# Altium project Datalogger.PrjPcb (part 1 of 2)
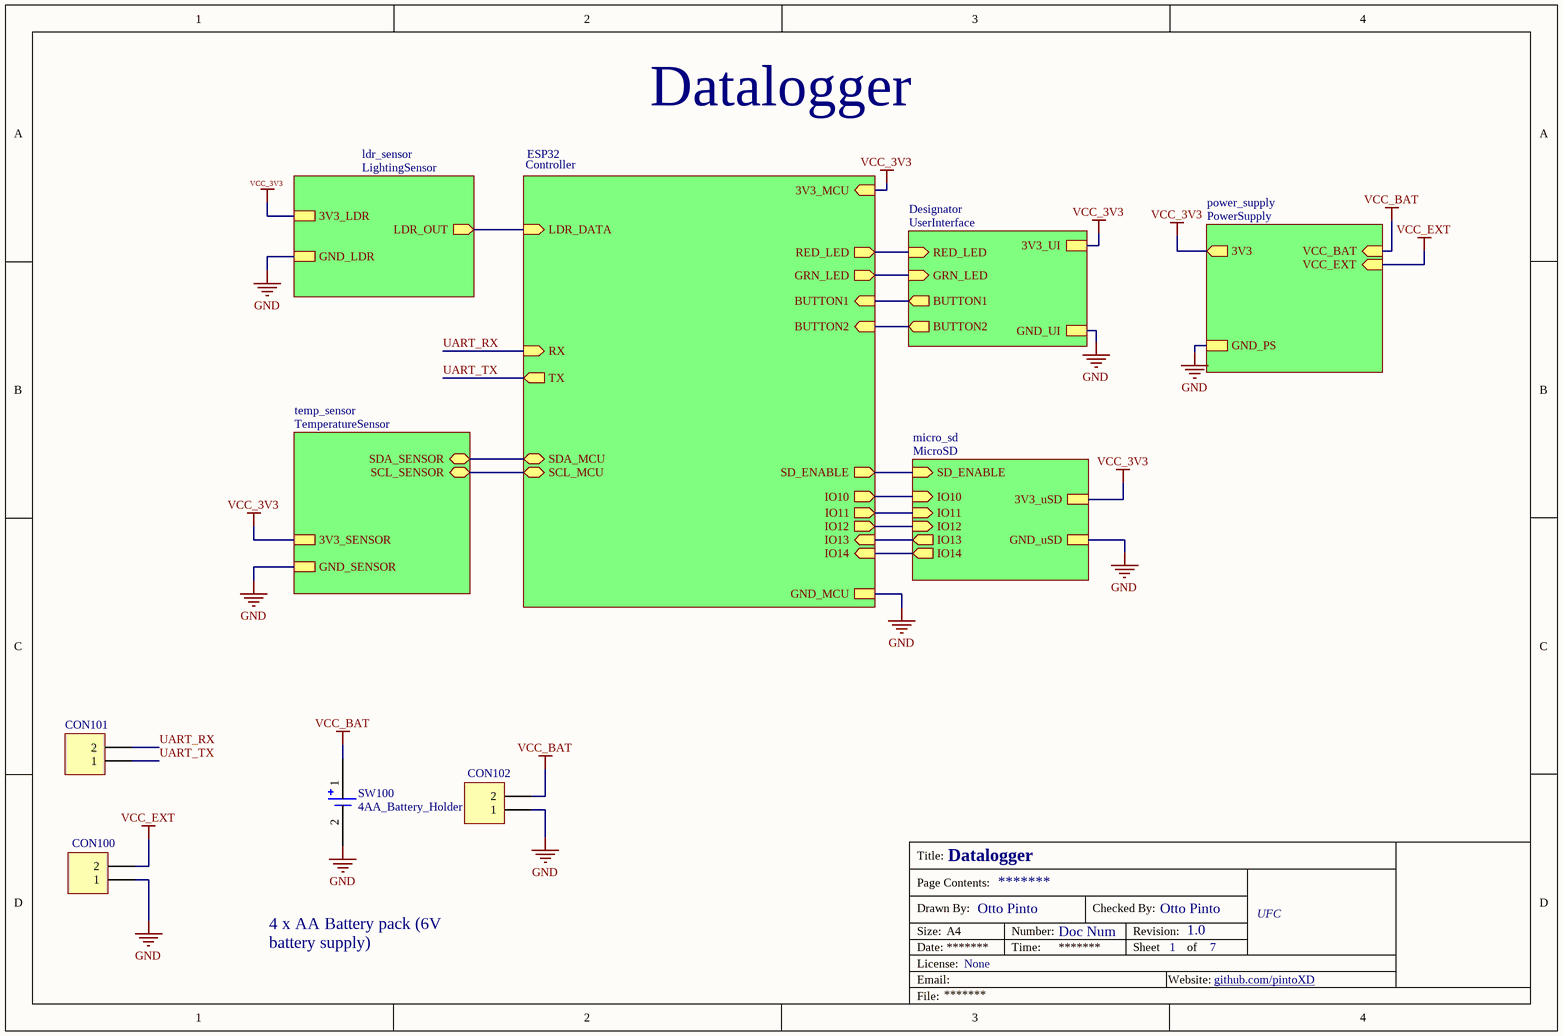
[diagram p0: datalogger.SchDoc]
VersionRevision: 1.0; RevisadoPor: Otto Pinto; Project: Datalogger; ProductName: Datalogger; Name: Otto Pinto; MY_EMAIL: ottolopes20@gmail.com; License: None; E-Mail: =MY_EMAIL; DocumentNumber: 1; DesenhadoPor: Otto Pinto; Company: UFC; Address_Website: github.com/pintoXD
7 sheets, 39 parts. Net scope: hierarchical (ports join the sheet entries above them; power ports are global).
Board file: datalogger.PcbDoc
Sheets:
  datalogger.SchDoc
    ESP32 = Controller.SchDoc
    power_supply = PowerSupply.SchDoc
    temp_sensor = TemperatureSensor.SchDoc
    ldr_sensor = LightingSensor.SchDoc
    micro_sd = MicroSD.SchDoc
    Designator = UserInterface.SchDoc

## Sheet datalogger.SchDoc: Datalogger
size A4; Title2: Datalogger; ENG_APP_DATE: --/--/--; DSN_APP_DATE: --/--/--; CHK_APP_DATE: --/--/--; Date: *******; ApprovedBy: *******; CheckedBy: None; Author: *******; CompanyName: *******; DrawnBy: Otto Pinto; Engineer: *******; Organization: *******; Address1: *******; Address2: *******; Address3: *******; Address4: *******; DocumentNumber: Doc Num; Revision: *******; SheetNumber: 1; SheetTotal: 7; CurrentTime: *******; CurrentDate: *******; Time: *******; DocumentFullPathAndName: *******; DocumentName: *******; ModifiedDate: *******; ImagePath: *******; ProjectName: *******; Application_BuildNumber: *******

### Parts
CON100  PIN HEADER 2POS  [FP-TSW-102-07-G-S-MFG]  (value not drawn)
CON101  PIN HEADER 2POS  [FP-TSW-102-07-G-S-MFG]  (value not drawn)
CON102  PIN HEADER 2POS  [FP-TSW-102-07-G-S-MFG]  (value not drawn)
SW100  4AA_Battery_Holder  [4AAA_BATTERY_HOLDER]

### Sub-sheets
Designator = UserInterface: GRN_LED (in), BUTTON1 (out), BUTTON2 (out), RED_LED (in), 3V3_UI, GND_UI
ESP32 = Controller: 3V3_MCU (in), SDA_MCU (bidir), SCL_MCU (bidir), LDR_DATA (in), GND_MCU, TX (out), RX (in), SD_ENABLE (out), GRN_LED (out), BUTTON1 (in), BUTTON2 (in), RED_LED (out), IO10 (out), IO11 (out), IO12 (out), IO13 (in), IO14 (in)
ldr_sensor = LightingSensor: 3V3_LDR, GND_LDR, LDR_OUT (out)
micro_sd = MicroSD: IO10 (in), IO11 (in), IO12 (in), IO13 (out), 3V3_uSD, GND_uSD, SD_ENABLE (in), IO14 (out)
power_supply = PowerSupply: VCC_BAT (in), VCC_EXT (in), 3V3 (out), GND_PS
temp_sensor = TemperatureSensor: SDA_SENSOR (bidir), SCL_SENSOR (bidir), 3V3_SENSOR, GND_SENSOR

### Nets
GND: CON100.1 CON102.1 SW100.2 ; sheet ESP32/GND_MCU, sheet power_supply/GND_PS, sheet temp_sensor/GND_SENSOR, sheet ldr_sensor/GND_LDR, sheet micro_sd/GND_uSD, sheet Designator/GND_UI
VCC_3V3: sheet ESP32/3V3_MCU, sheet power_supply/3V3, sheet temp_sensor/3V3_SENSOR, sheet ldr_sensor/3V3_LDR, sheet micro_sd/3V3_uSD, sheet Designator/3V3_UI  [project net 3V3]
VCC_BAT: CON102.2 SW100.1 ; sheet power_supply/VCC_BAT
VCC_EXT: CON100.2 ; sheet power_supply/VCC_EXT
BT1: sheet ESP32/BUTTON1, sheet Designator/BUTTON1
BT2: sheet ESP32/BUTTON2, sheet Designator/BUTTON2
CD: sheet ESP32/IO14, sheet micro_sd/IO14
CLK: sheet ESP32/IO12, sheet micro_sd/IO12
CMD: sheet ESP32/IO11, sheet micro_sd/IO11
D0: sheet ESP32/IO13, sheet micro_sd/IO13
D3: sheet ESP32/IO10, sheet micro_sd/IO10
GRN: sheet ESP32/GRN_LED, sheet Designator/GRN_LED
LDR_DATA: sheet ESP32/LDR_DATA, sheet ldr_sensor/LDR_OUT
RED: sheet ESP32/RED_LED, sheet Designator/RED_LED
SCL_SENSOR: sheet ESP32/SCL_MCU, sheet temp_sensor/SCL_SENSOR
SD_EN: sheet ESP32/SD_ENABLE, sheet micro_sd/SD_ENABLE
SDA_SENSOR: sheet ESP32/SDA_MCU, sheet temp_sensor/SDA_SENSOR
UART_RX: CON101.2 ; sheet ESP32/RX  [project net RXD0]
UART_TX: CON101.1 ; sheet ESP32/TX  [project net TXD0]

### Notes on the sheet
- 4 x AA Battery pack (6V battery supply)
- Title:
- Drawn By:
- Page Contents:
- Checked By:
- Size:
- Date:
- File:
- License:
- Email:
- A4
- Number:
- Time:
- Revision:
- Sheet
- Website:
- of

### Library data of the parts
CON100-CON102 = CMP-002-00076-1: Conn Unshrouded Header HDR 2 POS 2.54mm Solder ST Top Entry Thru-Hole Bulk; Manufacturer Part Number: TSW-102-07-G-S; Gender: Male; Connector Type: Male Pin; Max Current Rating: 7.6A; Number of Contacts: 2; Max Voltage Rating (AC): 550V; Length: 5.08mm; Depth: 2.54mm; Orientation: Straight; Termination: Solder; Packaging: Bulk; Number of Rows: 1; Contact Material: Bronze; Housing Color: Black; Pitch: 2.54mm; Contact Mating Length: 0.23inch; RoHS Compliant: Yes; Lead Free: Lead Free; Contact Type: Male Pin; Series: TSW; Contact Plating: Gold; Color: Black; Min Operating Temperature: -55°C; REACH SVHC: No SVHC; Housing Material: Polyester; Number of Positions: 2; Mount: Through Hole; Package Quantity: 1; Max Operating Temperature: 125°C
SW100 = 4AAA_battery_holder: Enclosure; Accessory; Battery Holder; Polypropylene; 26ga. 6in Leads; 4-AA; 4 * AA Battery Electronic Plastic Battery Case Storage Shell Box Holder with Wire Leads; Manufacturer: Bud Industries; Manufacturer Part Number: HH-3633; Number of Cells: 4; Supplier 1: Newark; RoHS: Yes; Category: Batteries and Accessories; Stock 1: 555; Pricing 1: 1=3,20000, 10=3,07000, 25=2,94000, 50=2,80000, 100=2,67000, 250=2,40000 (USD); Mount: Chassis; Material: PP,Polypropylene; Body Material: Polypropylene; Weight: 0.43oz; Color: Black; Package Quantity: 1; Termination: Wire Leads; Number of Batteries: 4; REACH SVHC: Unknown; Lead Free: Lead Free; ComponentLink1URL: https://datasheet.ciiva.com/4628/hb3633-36618-4628665.pdf?src-supplier=Mouser; ComponentLink1Description: https://datasheet.ciiva.com/4628/hb3633-36618-4628665.pdf?src-supplier=Mouser; ComponentLink2URL: https://datasheet.ciiva.com/16495/hb3633-16495410.pdf?src-supplier=Future+Electronics; ComponentLink2Description: https://datasheet.ciiva.com/16495/hb3633-16495410.pdf?src-supplier=Future+Electronics; ComponentLink3URL: https://datasheet.ciiva.com/1438/1807993-1438161.pdf?src-supplier=Newark; ComponentLink3Description: https://datasheet.ciiva.com/1438/1807993-1438161.pdf?src-supplier=Newark; Supplier Part Number 1: 34M2187

## Sheet Controller.SchDoc: Controle
size A4; ENG_APP_DATE: --/--/--; DSN_APP_DATE: --/--/--; CHK_APP_DATE: --/--/--; Date: *******; ApprovedBy: *******; CheckedBy: None; Author: *******; CompanyName: *******; Engineer: *******; Organization: *******; Address1: *******; Address2: *******; Address3: *******; Address4: *******; DocumentNumber: Doc Num; Revision: *******; SheetNumber: 2; SheetTotal: 7; CurrentTime: *******; CurrentDate: *******; Time: *******; DocumentFullPathAndName: *******; DocumentName: *******; ModifiedDate: *******; ImagePath: *******; ProjectName: *******; Application_BuildNumber: *******
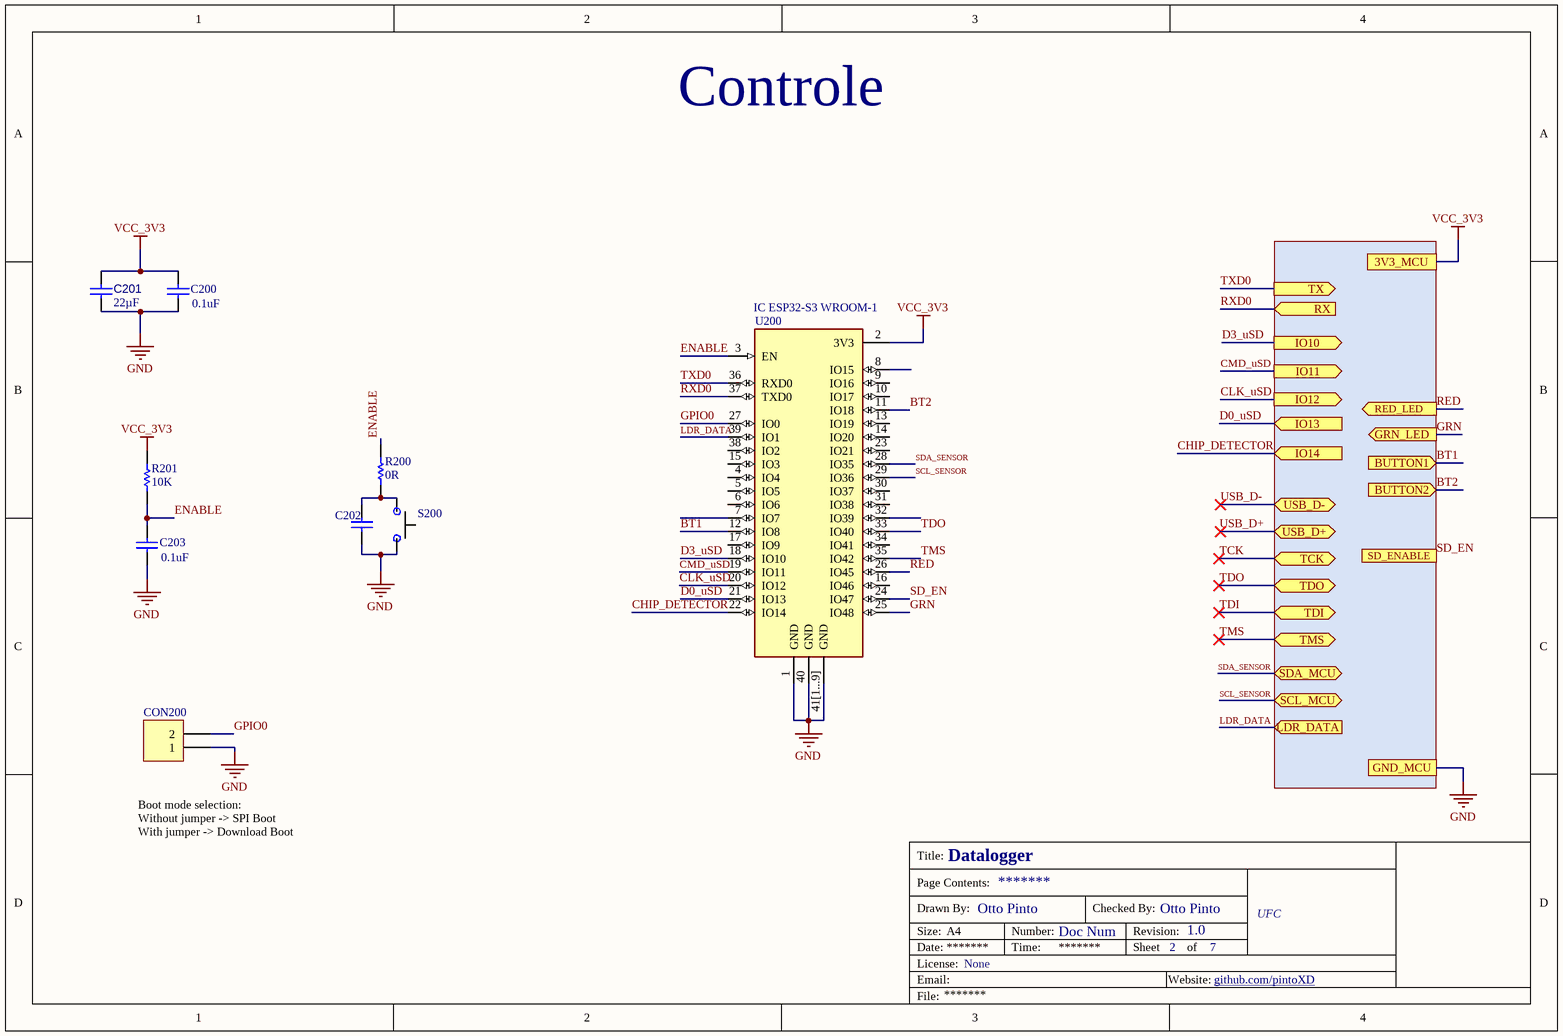
[diagram p1: Controller.SchDoc]

### Parts
C200  0.1uF  [CC2012-0805]
C201  value 22µF  [CC2012-0805]  (hidden comment: Capacitor 22µF +/-40% 16V 0805)
C202  CAP CER 0.1uF 100V X7R SMD 0805  [CC2012-0805]  (value not drawn)
C203  0.1uF  [CC2012-0805]
CON200  PIN HEADER 2POS  [FP-TSW-102-07-G-S-MFG]  (value not drawn)
R200  0R  [RESC2013X50X35ML15T15]
R201  10K  [CR2012-0805]
S200  SWITCH TACTILE SPST-NO 0.05A 12V SMD  [SWITCH_TACTILE_SMD_2PIN]  (value not drawn)
U200  IC ESP32-S3 WROOM-1  [ESP32_S3_WROOM_1]

### Ports
3V3_MCU, BUTTON1 (in), BUTTON2 (in), GND_MCU, GRN_LED (out), IO10 (out), IO11 (out), IO12 (out), IO13 (in), IO14 (in), LDR_DATA (in), RED_LED (out), RX (in), SCL_MCU (bidir), SD_ENABLE (out), SDA_MCU (bidir), TCK (bidir), TDI (bidir), TDO (bidir), TMS (bidir), TX (out), USB_D+ (bidir), USB_D- (bidir)

### Nets
GND: C200.1 C201.1 C202.1 C203.1 CON200.1 S200.1 U200.1(GND) U200.40(GND) U200.41[1...9](GND) ; port GND_MCU
VCC_3V3: C200.2 C201.2 R201.2 U200.2(3V3) ; port 3V3_MCU  [project net 3V3]
BT1: U200.12(IO8) ; port BUTTON1
BT2: U200.11(IO18) ; port BUTTON2
CHIP_DETECTOR: U200.22(IO14) ; port IO14  [project net CD]
CLK_uSD: U200.20(IO12) ; port IO12  [project net CLK]
CMD_uSD: U200.19(IO11) ; port IO11  [project net CMD]
D0_uSD: U200.21(IO13) ; port IO13  [project net D0]
D3_uSD: U200.18(IO10) ; port IO10  [project net D3]
ENABLE: C203.2 R200.2 R201.1 U200.3(EN)
GPIO0: CON200.2 U200.27(IO0)
GRN: U200.25(IO48) ; port GRN_LED
LDR_DATA: U200.39(IO1) ; port LDR_DATA
RED: U200.26(IO45) ; port RED_LED
RXD0: U200.37(TXD0) ; port RX
SCL_SENSOR: U200.29(IO36) ; port SCL_MCU
SD_EN: U200.24(IO47) ; port SD_ENABLE
SDA_SENSOR: U200.28(IO35) ; port SDA_MCU
TCK: port TCK
TDI: port TDI
TDO: U200.33(IO40) ; port TDO
TMS: U200.35(IO42) ; port TMS
TXD0: U200.36(RXD0) ; port TX
USB_D-: port USB_D-
NetC202_2: C202.2 R200.1 S200.2

Not connected (* = marked no-connect by the designer): U200 4(IO4) 5(IO5) 6(IO6) 7(IO7) 8(IO15) 9(IO16) 10(IO17) 13(IO19) 14(IO20) 15(IO3) 16(IO46) 17(IO9) 23(IO21) 30(IO37) 31(IO38) 32(IO39) 34(IO41) 38(IO2)

### Notes on the sheet
- (near CON200) Boot mode selection:
  Without jumper -> SPI Boot
  With jumper -> Download Boot
- Labels drawn without touching a wire or pin: USB_D+
- Title:
- Drawn By:
- Page Contents:
- Checked By:
- Size:
- Date:
- File:
- License:
- Email:
- A4
- Number:
- Time:
- Revision:
- Sheet
- Website:
- of

### Library data of the parts
C200 C202 C203 = CAP CER 0.1uF 25V 0805 SMD: Cap Ceramic 0.1uF 25V X7R 10% SMD 0805 125C Plastic T/R; Manufacturer: KEMET; Manufacturer Part Number: C0805C104K3RACTU; Capacitance: 100nF; Supplier 1: RSComponents; RoHS: Yes; Category: Ceramic Capacitors; Stock 1: 1910; Pricing 1: 10=0,13300, 100=0,12200, 250=0,11000, 500=0,09400, 1000=0,08300 (USD); Mount: PCB,Surface Mount; Case/Package: 0805; Case Code (Imperial): 0805; Case Code (Metric): 2012; Dielectric Material: Ceramic; Contact Plating: Tin,Matte; Min Operating Temperature: -55°C; Max Operating Temperature: 125°C; Packaging: Tape and Reel; Tolerance: 10%; Package Quantity: 4000; Voltage Rating: 25V; Series: C0805C; Voltage Rating (DC): 25V; Dielectric: X7R; Termination: SMD/SMT; Construction: Flat; Voltage: 25V; Length: 2mm; Width: 1.2mm; Height: 0.9mm; Depth: 1.25mm; Lead Pitch: 0.75mm; Radiation Hardening: No; RoHS Compliant: Yes; ComponentLink1URL: https://datasheet.ciiva.com/18193/getdatasheetpartid-385649-18193413.pdf?src-supplier=Verical; ComponentLink1Description: https://datasheet.ciiva.com/18193/getdatasheetpartid-385649-18193413.pdf?src-supplier=Verical; ComponentLink2URL: https://datasheet.ciiva.com/7842/kem-c1002-x7r-smd-7842536.pdf?src-supplier=Element14; ComponentLink2Description: https://datasheet.ciiva.com/7842/kem-c1002-x7r-smd-7842536.pdf?src-supplier=Element14; ComponentLink3URL: https://datasheet.ciiva.com/7842/kem-c1002-x7r-smd-7842538.pdf?src-supplier=Element14; ComponentLink3Description: https://datasheet.ciiva.com/7842/kem-c1002-x7r-smd-7842538.pdf?src-supplier=Element14; Supplier Part Number 1: 6480979
C201 = CMP-001-00081-6: Chip Capacitor, 22µF +/-40%, 16V, 0805, Thickness 1.45 mm; Tolerance: 5%; Mounting Technology: SMT; Min Operating Temperature: -55°C; Case/Package: 0805; Max Operating Temperature: 85°C; Voltage Rating: 16V; Pins: 2
CON200 = CMP-002-00076-1: as CON100 on sheet datalogger; Length: 5.08mm; Depth: 2.54mm; Orientation: Straight; Termination: Solder; Packaging: Bulk; Number of Rows: 1; Contact Material: Bronze; Housing Color: Black; Pitch: 2.54mm; Contact Mating Length: 0.23inch; RoHS Compliant: Yes; Lead Free: Lead Free; Contact Type: Male Pin; Series: TSW; Contact Plating: Gold; Color: Black; Min Operating Temperature: -55°C; REACH SVHC: No SVHC; Housing Material: Polyester; Number of Positions: 2; Mount: Through Hole; Package Quantity: 1; Max Operating Temperature: 125°C
R200 = CMP-009-00001-6: Chip Resistor, 0 Ohm, +/- 1%, 125 mW, -55 to 155 degC, 0805 (2012 Metric); Power: 125mW; Voltage Rating: 150V; Value: 0; Case/Package: 0805; Tolerance: 1%; Pins: 2; Mounting Technology: SM; Max Operating Temperature: 155°C; Min Operating Temperature: -55°C; RoHS Compliant: True
R201 = CMP-018-000030-1: RES 0805 10K Ohm 0.1% 1/10W  SMD; Manufacturer Part Number: ERJ-6ENF1002V; Manufacturer: Panasonic Electronic Components; Number of Resistors: 1; Voltage Rating (DC): 150V; Max Power Dissipation: 125mW; Temperature Coefficient: ±100ppm/°C; Tolerance: ±1%; Resistance: 10kR; Power (Watts): 0.125W, 1/8W; ComponentLink6URL: https://datasheet.ciiva.com/16725/70260748-16725031.pdf?src-supplier=Allied+Electronics; Package / Case: 0805 (2012 Metric); Supplier Device Package: 0805; Resistance (Ohms): 10k; ComponentLink14Description: https://datasheet.ciiva.com/24440/eng-ds-1773270-l-24440188.pdf?src-supplier=Onlinecomponents.com; Operating Temperature: -55°C ~ 155°C; ComponentLink15Description: https://datasheet.ciiva.com/7731/eng-ds-1773270-l-7731311.pdf?src-supplier=Element14; ComponentLink7Description: https://datasheet.ciiva.com/46372/1678782-46372714.pdf?src-supplier=Element14; ComponentLink13Description: https://datasheet.ciiva.com/16723/70063741-16723029.pdf?src-supplier=Allied+Electronics; Contact Plating: Tin; Part Status: Active; ComponentLink11Description: https://datasheet.ciiva.com/30140/aoa0000ce2-30140236.pdf?src-supplier=Onlinecomponents.com; ComponentLink6Description: https://datasheet.ciiva.com/16725/70260748-16725031.pdf?src-supplier=Allied+Electronics; Lead Free: Lead Free; ComponentLink14URL: https://datasheet.ciiva.com/24440/eng-ds-1773270-l-24440188.pdf?src-supplier=Onlinecomponents.com; Design Item ID: RES 10K OHM 1% 1/8W 0805 SMD; ComponentLink7URL: https://datasheet.ciiva.com/46372/1678782-46372714.pdf?src-supplier=Element14; ComponentLink3Description: https://datasheet.ciiva.com/16514/aoa0000ce2-16514021.pdf?src-supplier=Avnet+Asia; Category: Resistors; ComponentLink13URL: https://datasheet.ciiva.com/16723/70063741-16723029.pdf?src-supplier=Allied+Electronics; Case Code (Imperial): 0805; Failure Rate: -; Stock 1: 2392770; ComponentLink5URL: https://datasheet.ciiva.com/16759/70260748-16759350.pdf?src-supplier=Allied+Electronics; Features: Automotive AEC-Q200; ComponentLink12URL: https://datasheet.ciiva.com/24070/aoa0000ce2-24070702.pdf?src-supplier=Mouser; ComponentLink9URL: https://datasheet.ciiva.com/7830/426256-7830745.pdf?src-supplier=Element14; Termination: SMD/SMT; ComponentLink10Description: https://datasheet.ciiva.com/17212/aoa0000ce2-17212108.pdf?src-supplier=Avnet+Europe; Length: 2mm; ComponentLink15URL: https://datasheet.ciiva.com/7731/eng-ds-1773270-l-7731311.pdf?src-supplier=Element14; ComponentLink8Description: https://datasheet.ciiva.com/46372/1678782-46372715.pdf?src-supplier=Element14; ComponentLink11URL: https://datasheet.ciiva.com/30140/aoa0000ce2-30140236.pdf?src-supplier=Onlinecomponents.com; Size / Dimension: 0.079" L x 0.049" W (2.00mm x 1.25mm); ComponentLink9Description: https://datasheet.ciiva.com/7830/426256-7830745.pdf?src-supplier=Element14; REACH SVHC: No SVHC; Source: mits.SchLib; Military Standard: Not; ComponentLink5Description: https://datasheet.ciiva.com/16759/70260748-16759350.pdf?src-supplier=Allied+Electronics; ComponentLink1Description: https://industrial.panasonic.com/cdbs/www-data/pdf/RDA0000/AOA0000C283.pdf; ComponentLink16URL: https://datasheet.ciiva.com/14181/jcrn73-data-e-14181423.pdf?src-supplier=Distrelec; Stock 2: 1650; Working Voltage: 150V; ComponentLink8URL: https://datasheet.ciiva.com/46372/1678782-46372715.pdf?src-supplier=Element14; ComponentLink10URL: https://datasheet.ciiva.com/17212/aoa0000ce2-17212108.pdf?src-supplier=Avnet+Europe; Number of Pins: 2; Height: 0.6mm; ComponentLink4Description: https://datasheet.ciiva.com/27055/1988971-27055733.pdf?src-supplier=Jameco; ComponentLink4URL: https://datasheet.ciiva.com/27055/1988971-27055733.pdf?src-supplier=Jameco; Pricing 2: 1=1,68000, 10=1,48900, 100=1,13720, 1000=0,73645 (USD); Radiation Hardening: No; ComponentLink16Description: https://datasheet.ciiva.com/14181/jcrn73-data-e-14181423.pdf?src-supplier=Distrelec; Pricing 1: 1=0.1, 10=0.036, 25=0.0264, 50=0.02, 100=0.0148, 250=0.01124, 500=0.009, 1000=0.00663 (USD); ELV: Compliant; Width: 0.049inch; RoHS: RoHS Compliant; Number of Terminations: 2; ComponentLink2Description: https://datasheet.ciiva.com/11808/0900766b80f80784-11808080.pdf?src-supplier=RSComponents; Power Rating: 125mW; ComponentLink1URL: https://industrial.panasonic.com/cdbs/www-data/pdf/RDA0000/AOA0000C283.pdf; Mount: Surface Mount; Depth: 1.25mm; Case Code (Metric): 2012; ComponentLink12Description: https://datasheet.ciiva.com/24070/aoa0000ce2-24070702.pdf?src-supplier=Mouser; ComponentLink3URL: https://datasheet.ciiva.com/16514/aoa0000ce2-16514021.pdf?src-supplier=Avnet+Asia; ComponentLink2URL: https://datasheet.ciiva.com/11808/0900766b80f80784-11808080.pdf?src-supplier=RSComponents; Height - Seated (Max): 0.028" (0.70mm); Composition: Thick Film; Case/Package: 0805; Max Operating Temperature: 155°C; Packaging: Cut Tape (CT); Package Quantity: 5000; Voltage Rating: 150V; Min Operating Temperature: -55°C
S200 = CMP-019-000011-1: Switch Tactile N.O. SPST Rectangular Button J-Lead 0.05A 12VDC 2.55N SMD T/R; Manufacturer Part Number: TL3302BF260QJ; Manufacturer: E-Switch; Current Rating: 50mA; Operating Force: 260gf; Switch Travel: 0.25mm; Switch Function: Off-Mom; Actuator Material: Polyphenylene; Mechanical Life: 30000Cycles; Illumination Type: Non-Illuminated; ComponentLink1URL: https://datasheet.ciiva.com/2900/p020333b-2900880.pdf?src-supplier=Digi-Key; Design Item ID: SWITCH TACTILE SPST-NO 0.05A 12V SMD; Min Operating Temperature: -20°C; RoHS Compliant: Yes; Voltage Rating (DC): 12V; ComponentLink1Description: https://datasheet.ciiva.com/2900/p020333b-2900880.pdf?src-supplier=Digi-Key; Size: 11.4mm; Package Quantity: 1; Contact Plating: Silver; Lead Free: Lead Free; Termination: Gull Wing; Series: TL3302; Mount: Surface Mount; RoHS: Yes; Category: Tactile Switches; Stock 1: 19576; Throw Configuration: SPST; Packaging: Tape and Reel; Pricing 1: 1=0,82000, 10=0,79300, 25=0,74120, 100=0,64360, 250=0,58564, 500=0,54294 (USD); Source: mits.SchLib; Max Operating Temperature: 70°C
U200 = IC ESP32 S3 WROOM-1_v2: SMD Module, ESP32-S3R2 With 8 MB of Flash; Manufacturer Part Number: ESP32-S3-WROOM-1-N8; MF: Espressif Systems; SnapEDA_Link: https://www.snapeda.com/parts/ESP32-S3-WROOM-1U/Espressif+Systems/view-part/?ref=snap; Availability: Not in stock; Package: Package; Price: None; Value: *; Check_prices: https://www.snapeda.com/parts/ESP32-S3-WROOM-1U/Espressif+Systems/view-part/?ref=eda; Manufacturer: Espressif Systems; RoHS: No; Category: Uncategorized; Stock 1: 659; Pricing 1: 1=3,63000 (USD); Supplier 1: Digi-Key; Supplier Part Number 1: 1965-ESP32-S3-WROOM-1-N8CT-ND

## Sheet PowerSupply.SchDoc: Fonte de Alimentação
size A4; SPICEModelCacheZJBQYOKP: <root> / <DocumentId>ZJBQYOKP</DocumentId> / </root>; ENG_APP_DATE: --/--/--; DSN_APP_DATE: --/--/--; CHK_APP_DATE: --/--/--; Date: *******; ApprovedBy: *******; CheckedBy: None; Author: *******; CompanyName: *******; DrawnBy: Name; Engineer: *******; Organization: *******; Address1: *******; Address2: *******; Address3: *******; Address4: *******; DocumentNumber: Doc Num; Revision: *******; SheetNumber: 3; SheetTotal: 7; CurrentTime: *******; CurrentDate: *******; Time: *******; DocumentFullPathAndName: *******; DocumentName: *******; ModifiedDate: *******; ImagePath: *******; ProjectName: *******; Application_BuildNumber: *******
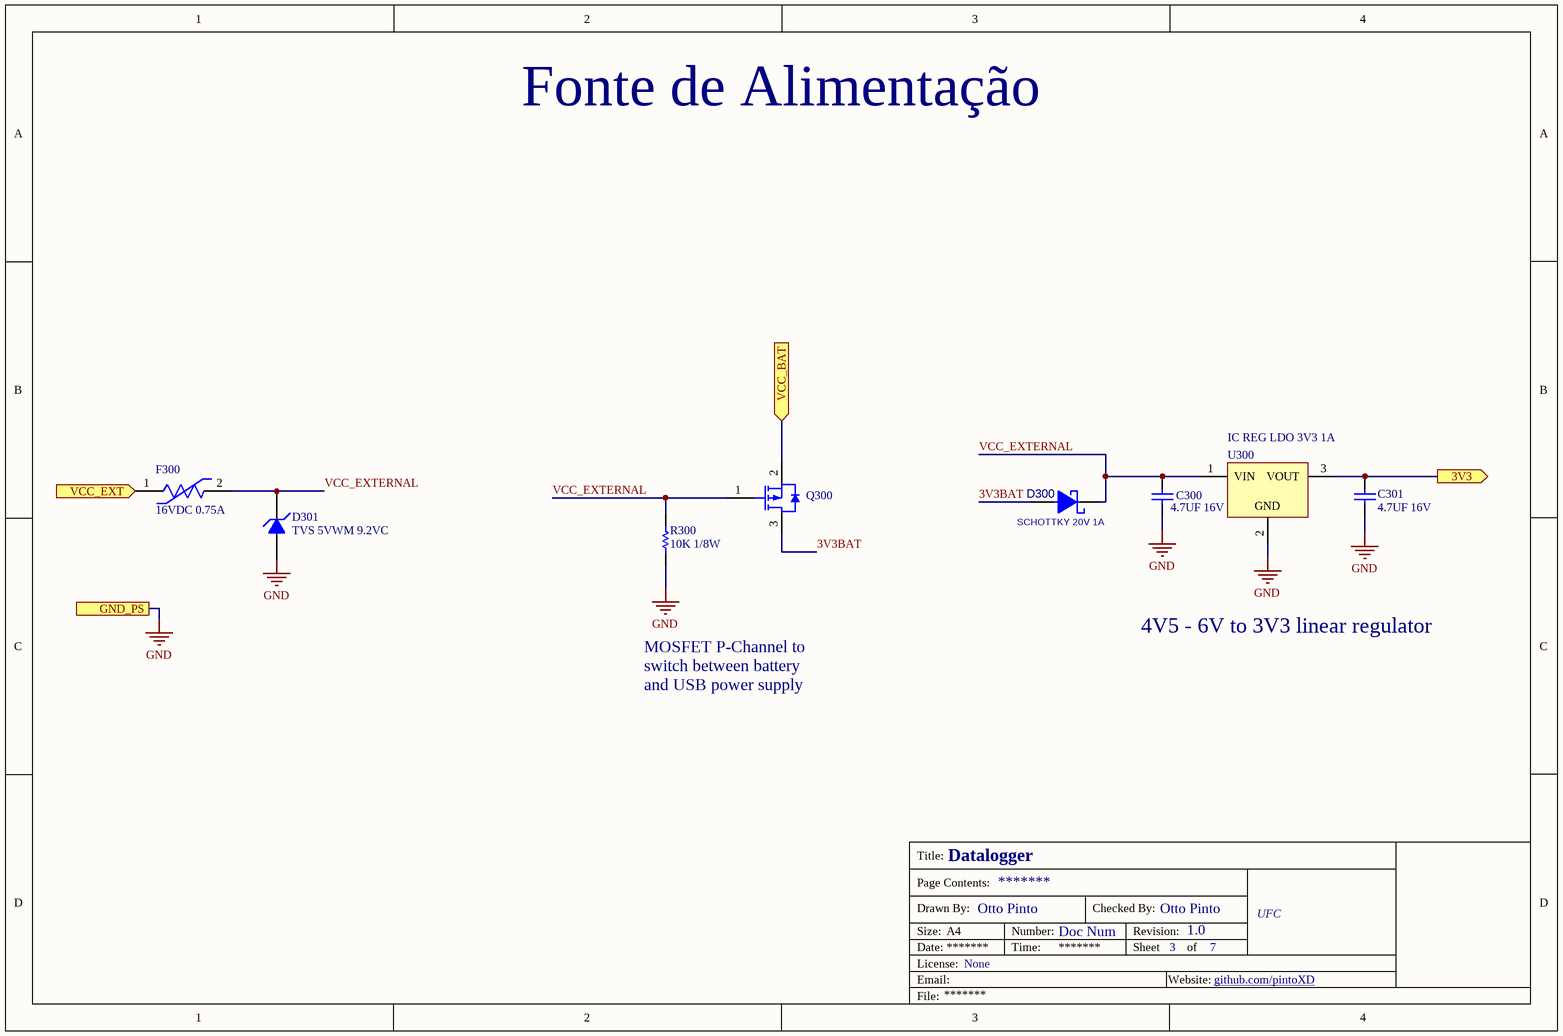
[diagram p2: PowerSupply.SchDoc]

### Parts
C300  4.7UF 16V  [CC2012-0805]
C301  4.7UF 16V  [CC2012-0805]
D300  SCHOTTKY 20V 1A  [SOD-323]
D301  TVS 5VWM 9.2VC  [DO-214AA(SMB)]
F300  16VDC 0.75A  [FP-0ZCJ0035FF2G-MFG]
Q300  IC MOSFET P_CHANNEL 20V 6A  [SOT-23]  (value not drawn)
R300  10K 1/8W  [CR2012-0805]
U300  IC REG LDO 3V3 1A  [SOT-223]

### Ports
3V3 (out), GND_PS, VCC_BAT (in), VCC_EXT (in)

### Nets
3V3: C301.2 U300.3(VOUT) ; port 3V3
GND: C300.1 C301.1 D301.2(A) R300.1 U300.2(GND) ; port GND_PS
VCC_BAT: Q300.2(SOURCE) ; port VCC_BAT
VCC_EXT: F300.1 ; port VCC_EXT
3V3BAT: D300.A Q300.3(DRAIN)
VCC_EXTERNAL: C300.2 D300.K D301.1(K) F300.2 Q300.1(GATE) R300.2 U300.1(VIN)

### Notes on the sheet
- 4V5 - 6V to 3V3 linear regulator
- MOSFET P-Channel to switch between battery and USB power supply
- Title:
- Drawn By:
- Page Contents:
- Checked By:
- Size:
- Date:
- File:
- License:
- Email:
- A4
- Number:
- Time:
- Revision:
- Sheet
- Website:
- of

### Library data of the parts
C300 C301 = CMP-004-000075-2: CAP CER 4.7UF 16V X7R 0805; Manufacturer Part Number 1: 0805F475M160NT; Manufacturer 1: FH(Guangdong Fenghua Advanced Tech); Tolerance: 10%; Radiation Hardening: No; Thickness: 0.057inch; Package Quantity: 1; REACH SVHC: No SVHC; Case Code (Imperial): 0805; Termination: SMD/SMT; Case/Package: 0805; Supplier Unit Price 1: 0,0214; Case Code (Metric): 2012; Dielectric: X7R; Ratings: AEC-Q200; Voltage Rating: 16V; Depth: 1.25mm; Length: 2mm; Source: mits.SchLib; Design Item ID: CAP CER 4.7uF 16V 20% Y5V 0805 SMD; Resistor Type: Ceramic; RoHS Compliant: Yes; Packaging: Tape and Reel; Weight: 0.000194oz; Min Operating Temperature: -55°C; Height: 1.25mm; Capacitance: 4.7uF; Voltage Rating (DC): 16V; Width: 0.049inch; Max Operating Temperature: 125°C; Series: CGA; Mount: Surface Mount; Lead Free: Lead Free
D300 = CMP-008-000014-1: DIODE SCHOTTKY 20V 1A SOD323; Manufacturer: ON Semiconductor; Manufacturer Part Number: NSR0320MW2T1G; Capacitance @ Vr, F: 29pF @ 5V, 1MHz; Speed: Fast Recovery =< 500ns, > 200mA (Io); Current - Reverse Leakage @ Vr: 50µA @ 15V; Current - Average Rectified (Io): 1A (DC); Voltage - Forward (Vf) (Max) @ If: 500mV @ 900mA; Pricing 1: 1=0.4, 10=0.298, 100=0.1689, 500=0.11188, 1000=0.08577 (USD); Design Item ID: DIODE SCHOTTKY NSR0320MW2T1G 20V 1A SOD323 SMD; Supplier Device Package: SOD-323; ComponentLink1URL: http://www.onsemi.com/pub_link/Collateral/NSR0320MW2T1-D.PDF; Packaging: Cut Tape (CT); Package / Case: SC-76, SOD-323; ComponentLink1Description: http://www.onsemi.com/pub_link/Collateral/NSR0320MW2T1-D.PDF; Reverse Recovery Time (trr): -; Voltage - DC Reverse (Vr) (Max): 20V; RoHS: RoHS Compliant; Mounting Type: Surface Mount; Diode Type: Schottky; Category: Discrete Semiconductor Products; Operating Temperature - Junction: -55°C ~ 125°C; Part Status: Active; Stock 1: 617; Source: mits.SchLib
D301 = CMP-004-00039-1: TVS DIODE 5VWM 9.2VC SMB; Element Configuration: Single; Number of Channels: 1; Test Current: 10mA; Voltage Rating (DC): 5V; Min Breakdown Voltage: 6.4V; Polarity: Unidirectional; Clamping Voltage: 9.2V; Leakage Current: 800uA; Max Surge Current: 65.3A; Max Power Dissipation: 600W; Current: 68A; Diode Type: ZENER; Power Line Protection: No; Max Breakdown Voltage: 7V; ESD Protection: Yes; Length: 4.57mm; Radiation Hardening: No; RoHS Compliant: Yes; Packaging: Cut Tape; Breakdown Voltage: 6.4V; Min Operating Temperature: -65°C; Voltage: 5V; Operating Supply Voltage: 5V; Reverse Breakdown Voltage: 6.4V; Peak Pulse Current: 65.3A; Max Operating Temperature: 150°C; Mount: Surface Mount; Number of Elements: 1; Termination: SMD/SMT; Package Quantity: 3000; Number of Unidirectional Channels: 1; Clamping Voltage-Max: 9.2V; Peak Pulse Power: 600W; Reverse Standoff Voltage: 5V; Direction: Unidirectional; Number of Pins: 2; Width: 3.94mm; Power Dissipation: 600W; Series: SMBJ; Case/Package: DO-214AA; Lead Free: Lead Free; Height: 2.237mm; Resistor Type: Zener; Max Reverse Leakage Current: 800uA; REACH SVHC: Unknown
F300 = CMP-005-00014-2: PTC Resettable Fuse 0.35A(hold) 0.75A(trip) 16VDC 40A 0.4W 0.1s 0.3Ohm SMD Solder Pad 1206 T/R Automotive; Trip Current: 750mA; Hold Current: 350mA; Time to Trip: 100ms; RoHS Compliant: Yes; Packaging: Cut Tape; Min Operating Temperature: -40°C; Mount: Surface Mount; Series: 0ZCJ; Case Code (Imperial): 1206; Case Code (Metric): 3216; Package Quantity: 1; Lead Free: Lead Free; Case/Package: 1206; Max Operating Temperature: 85°C; Max Current Rating: 40A
Q300 = IC MOSFET P_CHANNEL 20V 6A: Small Low ON Resistance MOSFET P-Channel 20V 6A 3-Pin SOT-23F T/R; Manufacturer: Toshiba; Manufacturer Part Number: SSM3J358R,LF; ComponentLink1URL: https://datasheet.ciiva.com/30023/dmp31d0u-30023794.pdf?src-supplier=Avnet; ComponentLink1Description: https://datasheet.ciiva.com/30023/dmp31d0u-30023794.pdf?src-supplier=Avnet; Supplier 1: Avnet; RoHS: No; Category: MOSFETs; Stock 1: 12000; Pricing 1: 3000=0,10175, 6000=0,09625, 12000=0,09075, 18000=0,08525, 24000=0,07975, 30000=0,07425, 300000=0,06875 (USD); Supplier 2: LCSC; Supplier Part Number 1: SSM3J358R,LF; Supplier Part Number 2: C148356
R300 = CMP-018-000030-1: as R201 on sheet Controller; ComponentLink6URL: https://datasheet.ciiva.com/16725/70260748-16725031.pdf?src-supplier=Allied+Electronics; Package / Case: 0805 (2012 Metric); Supplier Device Package: 0805; Resistance (Ohms): 10k; ComponentLink14Description: https://datasheet.ciiva.com/24440/eng-ds-1773270-l-24440188.pdf?src-supplier=Onlinecomponents.com; Operating Temperature: -55°C ~ 155°C; ComponentLink15Description: https://datasheet.ciiva.com/7731/eng-ds-1773270-l-7731311.pdf?src-supplier=Element14; ComponentLink7Description: https://datasheet.ciiva.com/46372/1678782-46372714.pdf?src-supplier=Element14; ComponentLink13Description: https://datasheet.ciiva.com/16723/70063741-16723029.pdf?src-supplier=Allied+Electronics; Contact Plating: Tin; Part Status: Active; ComponentLink11Description: https://datasheet.ciiva.com/30140/aoa0000ce2-30140236.pdf?src-supplier=Onlinecomponents.com; ComponentLink6Description: https://datasheet.ciiva.com/16725/70260748-16725031.pdf?src-supplier=Allied+Electronics; Lead Free: Lead Free; ComponentLink14URL: https://datasheet.ciiva.com/24440/eng-ds-1773270-l-24440188.pdf?src-supplier=Onlinecomponents.com; Design Item ID: RES 10K OHM 1% 1/8W 0805 SMD; ComponentLink7URL: https://datasheet.ciiva.com/46372/1678782-46372714.pdf?src-supplier=Element14; ComponentLink3Description: https://datasheet.ciiva.com/16514/aoa0000ce2-16514021.pdf?src-supplier=Avnet+Asia; Category: Resistors; ComponentLink13URL: https://datasheet.ciiva.com/16723/70063741-16723029.pdf?src-supplier=Allied+Electronics; Case Code (Imperial): 0805; Failure Rate: -; Stock 1: 2392770; ComponentLink5URL: https://datasheet.ciiva.com/16759/70260748-16759350.pdf?src-supplier=Allied+Electronics; Features: Automotive AEC-Q200; ComponentLink12URL: https://datasheet.ciiva.com/24070/aoa0000ce2-24070702.pdf?src-supplier=Mouser; ComponentLink9URL: https://datasheet.ciiva.com/7830/426256-7830745.pdf?src-supplier=Element14; Termination: SMD/SMT; ComponentLink10Description: https://datasheet.ciiva.com/17212/aoa0000ce2-17212108.pdf?src-supplier=Avnet+Europe; Length: 2mm; ComponentLink15URL: https://datasheet.ciiva.com/7731/eng-ds-1773270-l-7731311.pdf?src-supplier=Element14; ComponentLink8Description: https://datasheet.ciiva.com/46372/1678782-46372715.pdf?src-supplier=Element14; ComponentLink11URL: https://datasheet.ciiva.com/30140/aoa0000ce2-30140236.pdf?src-supplier=Onlinecomponents.com; Size / Dimension: 0.079" L x 0.049" W (2.00mm x 1.25mm); ComponentLink9Description: https://datasheet.ciiva.com/7830/426256-7830745.pdf?src-supplier=Element14; REACH SVHC: No SVHC; Source: mits.SchLib; Military Standard: Not; ComponentLink5Description: https://datasheet.ciiva.com/16759/70260748-16759350.pdf?src-supplier=Allied+Electronics; ComponentLink1Description: https://industrial.panasonic.com/cdbs/www-data/pdf/RDA0000/AOA0000C283.pdf; ComponentLink16URL: https://datasheet.ciiva.com/14181/jcrn73-data-e-14181423.pdf?src-supplier=Distrelec; Stock 2: 1650; Working Voltage: 150V; ComponentLink8URL: https://datasheet.ciiva.com/46372/1678782-46372715.pdf?src-supplier=Element14; ComponentLink10URL: https://datasheet.ciiva.com/17212/aoa0000ce2-17212108.pdf?src-supplier=Avnet+Europe; Number of Pins: 2; Height: 0.6mm; ComponentLink4Description: https://datasheet.ciiva.com/27055/1988971-27055733.pdf?src-supplier=Jameco; ComponentLink4URL: https://datasheet.ciiva.com/27055/1988971-27055733.pdf?src-supplier=Jameco; Pricing 2: 1=1,68000, 10=1,48900, 100=1,13720, 1000=0,73645 (USD); Radiation Hardening: No; ComponentLink16Description: https://datasheet.ciiva.com/14181/jcrn73-data-e-14181423.pdf?src-supplier=Distrelec; Pricing 1: 1=0.1, 10=0.036, 25=0.0264, 50=0.02, 100=0.0148, 250=0.01124, 500=0.009, 1000=0.00663 (USD); ELV: Compliant; Width: 0.049inch; RoHS: RoHS Compliant; Number of Terminations: 2; ComponentLink2Description: https://datasheet.ciiva.com/11808/0900766b80f80784-11808080.pdf?src-supplier=RSComponents; Power Rating: 125mW; ComponentLink1URL: https://industrial.panasonic.com/cdbs/www-data/pdf/RDA0000/AOA0000C283.pdf; Mount: Surface Mount; Depth: 1.25mm; Case Code (Metric): 2012; ComponentLink12Description: https://datasheet.ciiva.com/24070/aoa0000ce2-24070702.pdf?src-supplier=Mouser; ComponentLink3URL: https://datasheet.ciiva.com/16514/aoa0000ce2-16514021.pdf?src-supplier=Avnet+Asia; ComponentLink2URL: https://datasheet.ciiva.com/11808/0900766b80f80784-11808080.pdf?src-supplier=RSComponents; Height - Seated (Max): 0.028" (0.70mm); Composition: Thick Film; Case/Package: 0805; Max Operating Temperature: 155°C; Packaging: Cut Tape (CT); Package Quantity: 5000; Voltage Rating: 150V; Min Operating Temperature: -55°C
U300 = IC REG LDO 3V3 1A: IC REG LDO 3.3V 1A SOT223; Manufacturer: Diodes; Manufacturer Part Number: AP2114HA-3.3TRG1; Dropout Voltage: 450mV; Number of Regulators: 1; Polarity: Positive; Quiescent Current: 90uA; Accuracy: 1.5%; Min Input Voltage: 2.5V; Max Input Voltage: 6V; Output Type: Fixed; Supplier 1: Digi-Key; RoHS: Yes; Category: Voltage Regulators - Linear; Stock 1: 1890; Pricing 1: 1=0,39000, 10=0,31700, 25=0,29000, 100=0,21570, 250=0,19552, 500=0,16180, 1000=0,12135 (USD); Mount: Surface Mount; Case/Package: TO-261-4; Number of Pins: 3; Contact Plating: Tin; Min Operating Temperature: -40°C; Max Operating Temperature: 85°C; Packaging: Tape and Reel; Package Quantity: 4000; Output Voltage: 3.3V; Output Current: 1A; Max Output Current: 1A; Number of Outputs: 1; RoHS Compliant: Yes; ComponentLink1URL: https://datasheet.ciiva.com/29568/ap2114-29568886.pdf?src-supplier=Digi-Key; ComponentLink1Description: https://datasheet.ciiva.com/29568/ap2114-29568886.pdf?src-supplier=Digi-Key; Supplier Part Number 1: AP2114HA-3.3TRG1DICT-ND

## Sheet TemperatureSensor.SchDoc: Sensor de Temperatura
size A4; ENG_APP_DATE: --/--/--; DSN_APP_DATE: --/--/--; CHK_APP_DATE: --/--/--; Date: *******; ApprovedBy: *******; CheckedBy: None; Author: *******; CompanyName: *******; DrawnBy: Name; Engineer: *******; Organization: *******; Address1: *******; Address2: *******; Address3: *******; Address4: *******; DocumentNumber: Doc Num; Revision: *******; SheetNumber: 4; SheetTotal: 7; CurrentTime: *******; CurrentDate: *******; Time: *******; DocumentFullPathAndName: *******; DocumentName: *******; ModifiedDate: *******; ImagePath: *******; ProjectName: *******; Application_BuildNumber: *******
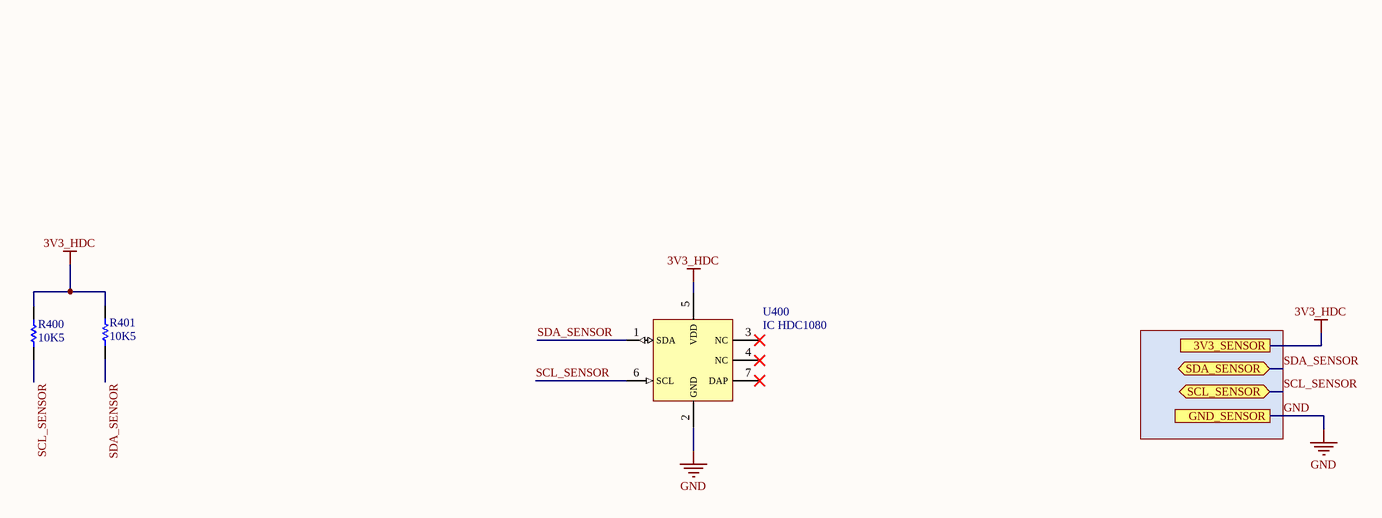
[diagram p3: TemperatureSensor.SchDoc]

### Parts
R400  10K5  [CR2012-0805]
R401  10K5  [CR2012-0805]
U400  IC HDC1080  [PSON100P300X80_HS-7N]

### Ports
3V3_SENSOR, GND_SENSOR, SCL_SENSOR (bidir), SDA_SENSOR (bidir)

### Nets
3V3_HDC: R400.2 R401.2 U400.5(VDD) ; port 3V3_SENSOR  [project net 3V3]
GND: U400.2(GND) ; port GND_SENSOR
SCL_SENSOR: R400.1 U400.6(SCL) ; port SCL_SENSOR
SDA_SENSOR: R401.1 U400.1(SDA) ; port SDA_SENSOR

Not connected (* = marked no-connect by the designer): U400 3(NC)* 4(NC)* 7(DAP)*

### Notes on the sheet
- Title:
- Drawn By:
- Page Contents:
- Checked By:
- Size:
- Date:
- File:
- License:
- Email:
- A4
- Number:
- Time:
- Revision:
- Sheet
- Website:
- of

### Library data of the parts
R400 R401 = CMP-018-000099-1: RES SMD 10.5K OHM 0.1% 1/8W 0805; Manufacturer: Panasonic Electronic Components; Manufacturer Part Number: ERA-6AEB1052V; Power (Watts): 0.125W, 1/8W; Temperature Coefficient: ±25ppm/°C; Tolerance: ±0.1%; Part Status: Active; Design Item ID: RES 10K5 OHM 0.1% 1/8W 0805 SMD; Height: 0.024" (0.60mm); Packaging: Cut Tape (CT); Source: mits.SchLib; Number of Terminations: 2; Resistance (Ohms): 10.5k; Stock 1: 1614; Supplier Device Package: 0805; Category: Resistors; Size / Dimension: 0.079" L x 0.049" W (2.00mm x 1.25mm); RoHS: RoHS Compliant; Pricing 1: 1=0.63, 50=0.2494, 100=0.1924, 250=0.14964, 500=0.10546, 1000=0.07695 (USD); Features: Automotive AEC-Q200; Composition: Thin Film; Package / Case: 0805 (2012 Metric); ComponentLink1URL: http://media.digikey.com/pdf/Data%20Sheets/Panasonic%20Electronic%20Components/ERA%201A,2A,3A,6A,8A.pdf; Operating Temperature: -55°C ~ 155°C; ComponentLink1Description: http://media.digikey.com/pdf/Data%20Sheets/Panasonic%20Electronic%20Components/ERA%201A,2A,3A,6A,8A.pdf
U400 = CMP-023-000042-1: SENSOR HUMI/TEMP 3.3V I2C 4% SMD; Manufacturer 1: Texas Instruments; Manufacturer Part Number 1: HDC1080DMBR; Sensor Type: Temperature; Max Supply Voltage: 5.5V; Response Time: 15s; Accuracy: 2%; Output Type: I2C,Voltage; Min Supply Voltage: 2.7V; ComponentLink2URL: http://www.ti.com/general/docs/suppproductinfo.tsp?distId=10&amp;gotoUrl=http%3A%2F%2Fwww.ti.com%2Flit%2Fgpn%2Fhdc1080&src-supplier=Digi-Key; Interface: I2C; ComponentLink2Description: http://www.ti.com/general/docs/suppproductinfo.tsp?distId=10&amp;gotoUrl=http%3A%2F%2Fwww.ti.com%2Flit%2Fgpn%2Fhdc1080&src-supplier=Digi-Key; Lead Free: Lead Free; ComponentLink1URL: http://www.ti.com/lit/ds/symlink/hdc1080.pdf?src-supplier=Digi-Key; Category: Integrated Circuits (ICs); Mount: Surface Mount; RoHS: Yes; Contact Plating: Gold; Design Item ID: IC HDC1080 TEMP/HUMID SENSOR 6-PWSON; Source: mits.SchLib; ComponentLink3Description: http://www.ti.com/lit/ds/symlink/hdc1080.pdf?src-supplier=Avnet+Asia; ComponentLink3URL: http://www.ti.com/lit/ds/symlink/hdc1080.pdf?src-supplier=Avnet+Asia; ComponentLink1Description: http://www.ti.com/lit/ds/symlink/hdc1080.pdf?src-supplier=Digi-Key; Max Operating Temperature: 125°C; Min Operating Temperature: -40°C; Stock 1: 72; Pricing 1: 1=2,81800, 10=2,40190, 30=2,29790, 100=2,16440, 500=2,10100, 1000=2,08970, 1=2,69760, 10=2,29930, 30=2,19960, 100=2,07190, 500=2,01120, 1000=2,00040, 1=14,08600, 10=12,00600, 30=11,48590, 100=10,81860, 500=10,50210, 1000=10,44560, 1=13,56590, 10=11,56280, 30=11,06190, 100=10,41920, 500=10,11440, 1000=10,06000, 1=1,82390, 10=1,55460, 30=1,48720, 100=1,40080, 500=1,35990, 1000=1,35250, 1=1,55080, 10=1,32180, 30=1,26460, 100=1,19110, 500=1,15630, 1000=1,15000, 1=16,67800, 10=14,21530, 30=13,59950, 100=12,80940, 500=12,43460, 1000=12,36770, 1=237,44120, 10=202,38070, 30=193,61280, 100=182,36520, 500=177,02920, 1000=176,07710, 1=8,88030, 10=7,56900, 30=7,24110, 100=6,82040, 500=6,62090, 1000=6,58530, 1=163,93950, 10=139,73230, 30=133,67860, 100=125,91270, 500=122,22850, 1000=121,57110, 1=18,70970, 10=15,94710, 30=15,25620, 100=14,36990, 500=13,94940, 1000=13,87440, 1=2,88620, 10=2,46000, 30=2,35340, 100=2,21670, 500=2,15180, 1000=2,14030, 1=2,14480, 10=1,82810, 30=1,74890, 100=1,64730, 500=1,59910, 1000=1,59050 (AUD); RoHS Compliant: Yes

## Sheet LightingSensor.SchDoc: Sensor de Luminosidade
size A4; ENG_APP_DATE: --/--/--; DSN_APP_DATE: --/--/--; CHK_APP_DATE: --/--/--; Date: *******; ApprovedBy: *******; CheckedBy: None; Author: *******; CompanyName: *******; DrawnBy: Name; Engineer: *******; Organization: *******; Address1: *******; Address2: *******; Address3: *******; Address4: *******; DocumentNumber: Doc Num; Revision: *******; SheetNumber: 5; SheetTotal: 7; CurrentTime: *******; CurrentDate: *******; Time: *******; DocumentFullPathAndName: *******; DocumentName: *******; ModifiedDate: *******; ImagePath: *******; ProjectName: *******; Application_BuildNumber: *******
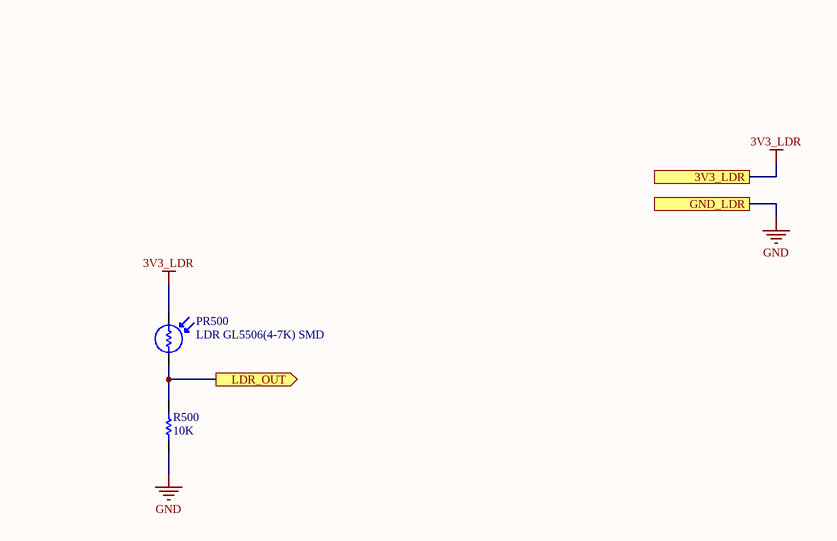
[diagram p4: LightingSensor.SchDoc]

### Parts
PR500  LDR GL5506(4-7K) SMD  [LDR 3x0.5]
R500  10K  [CR2012-0805]

### Ports
3V3_LDR, GND_LDR, LDR_OUT (out)

### Nets
3V3_LDR: PR500.1 ; port 3V3_LDR  [project net 3V3]
GND: R500.1 ; port GND_LDR
LDR_DATA: PR500.2 R500.2 ; port LDR_OUT

### Notes on the sheet
- Title:
- Drawn By:
- Page Contents:
- Checked By:
- Size:
- Date:
- File:
- License:
- Email:
- A4
- Number:
- Time:
- Revision:
- Sheet
- Website:
- of

### Library data of the parts
PR500 = CMP-017-000003-1: THROUGH HOLE PHOTORESISTORS ROHS; Manufacturer 1: JCHL(Shenzhen Jing Chuang He Li Tech); Manufacturer Part Number 1: GL5506(4-7K); Design Item ID: LDR GL5506(4-7K) SMD; Source: mits.SchLib
R500 = CMP-018-000030-1: as R201 on sheet Controller; ComponentLink6URL: https://datasheet.ciiva.com/16725/70260748-16725031.pdf?src-supplier=Allied+Electronics; Package / Case: 0805 (2012 Metric); Supplier Device Package: 0805; Resistance (Ohms): 10k; ComponentLink14Description: https://datasheet.ciiva.com/24440/eng-ds-1773270-l-24440188.pdf?src-supplier=Onlinecomponents.com; Operating Temperature: -55°C ~ 155°C; ComponentLink15Description: https://datasheet.ciiva.com/7731/eng-ds-1773270-l-7731311.pdf?src-supplier=Element14; ComponentLink7Description: https://datasheet.ciiva.com/46372/1678782-46372714.pdf?src-supplier=Element14; ComponentLink13Description: https://datasheet.ciiva.com/16723/70063741-16723029.pdf?src-supplier=Allied+Electronics; Contact Plating: Tin; Part Status: Active; ComponentLink11Description: https://datasheet.ciiva.com/30140/aoa0000ce2-30140236.pdf?src-supplier=Onlinecomponents.com; ComponentLink6Description: https://datasheet.ciiva.com/16725/70260748-16725031.pdf?src-supplier=Allied+Electronics; Lead Free: Lead Free; ComponentLink14URL: https://datasheet.ciiva.com/24440/eng-ds-1773270-l-24440188.pdf?src-supplier=Onlinecomponents.com; Design Item ID: RES 10K OHM 1% 1/8W 0805 SMD; ComponentLink7URL: https://datasheet.ciiva.com/46372/1678782-46372714.pdf?src-supplier=Element14; ComponentLink3Description: https://datasheet.ciiva.com/16514/aoa0000ce2-16514021.pdf?src-supplier=Avnet+Asia; Category: Resistors; ComponentLink13URL: https://datasheet.ciiva.com/16723/70063741-16723029.pdf?src-supplier=Allied+Electronics; Case Code (Imperial): 0805; Failure Rate: -; Stock 1: 2392770; ComponentLink5URL: https://datasheet.ciiva.com/16759/70260748-16759350.pdf?src-supplier=Allied+Electronics; Features: Automotive AEC-Q200; ComponentLink12URL: https://datasheet.ciiva.com/24070/aoa0000ce2-24070702.pdf?src-supplier=Mouser; ComponentLink9URL: https://datasheet.ciiva.com/7830/426256-7830745.pdf?src-supplier=Element14; Termination: SMD/SMT; ComponentLink10Description: https://datasheet.ciiva.com/17212/aoa0000ce2-17212108.pdf?src-supplier=Avnet+Europe; Length: 2mm; ComponentLink15URL: https://datasheet.ciiva.com/7731/eng-ds-1773270-l-7731311.pdf?src-supplier=Element14; ComponentLink8Description: https://datasheet.ciiva.com/46372/1678782-46372715.pdf?src-supplier=Element14; ComponentLink11URL: https://datasheet.ciiva.com/30140/aoa0000ce2-30140236.pdf?src-supplier=Onlinecomponents.com; Size / Dimension: 0.079" L x 0.049" W (2.00mm x 1.25mm); ComponentLink9Description: https://datasheet.ciiva.com/7830/426256-7830745.pdf?src-supplier=Element14; REACH SVHC: No SVHC; Source: mits.SchLib; Military Standard: Not; ComponentLink5Description: https://datasheet.ciiva.com/16759/70260748-16759350.pdf?src-supplier=Allied+Electronics; ComponentLink1Description: https://industrial.panasonic.com/cdbs/www-data/pdf/RDA0000/AOA0000C283.pdf; ComponentLink16URL: https://datasheet.ciiva.com/14181/jcrn73-data-e-14181423.pdf?src-supplier=Distrelec; Stock 2: 1650; Working Voltage: 150V; ComponentLink8URL: https://datasheet.ciiva.com/46372/1678782-46372715.pdf?src-supplier=Element14; ComponentLink10URL: https://datasheet.ciiva.com/17212/aoa0000ce2-17212108.pdf?src-supplier=Avnet+Europe; Number of Pins: 2; Height: 0.6mm; ComponentLink4Description: https://datasheet.ciiva.com/27055/1988971-27055733.pdf?src-supplier=Jameco; ComponentLink4URL: https://datasheet.ciiva.com/27055/1988971-27055733.pdf?src-supplier=Jameco; Pricing 2: 1=1,68000, 10=1,48900, 100=1,13720, 1000=0,73645 (USD); Radiation Hardening: No; ComponentLink16Description: https://datasheet.ciiva.com/14181/jcrn73-data-e-14181423.pdf?src-supplier=Distrelec; Pricing 1: 1=0.1, 10=0.036, 25=0.0264, 50=0.02, 100=0.0148, 250=0.01124, 500=0.009, 1000=0.00663 (USD); ELV: Compliant; Width: 0.049inch; RoHS: RoHS Compliant; Number of Terminations: 2; ComponentLink2Description: https://datasheet.ciiva.com/11808/0900766b80f80784-11808080.pdf?src-supplier=RSComponents; Power Rating: 125mW; ComponentLink1URL: https://industrial.panasonic.com/cdbs/www-data/pdf/RDA0000/AOA0000C283.pdf; Mount: Surface Mount; Depth: 1.25mm; Case Code (Metric): 2012; ComponentLink12Description: https://datasheet.ciiva.com/24070/aoa0000ce2-24070702.pdf?src-supplier=Mouser; ComponentLink3URL: https://datasheet.ciiva.com/16514/aoa0000ce2-16514021.pdf?src-supplier=Avnet+Asia; ComponentLink2URL: https://datasheet.ciiva.com/11808/0900766b80f80784-11808080.pdf?src-supplier=RSComponents; Height - Seated (Max): 0.028" (0.70mm); Case/Package: 0805; Max Operating Temperature: 155°C; Packaging: Cut Tape (CT); Package Quantity: 5000; Voltage Rating: 150V; Min Operating Temperature: -55°C; Composition: Thick Film

## Sheet MicroSD.SchDoc: Cartão SD
size A4; ENG_APP_DATE: --/--/--; DSN_APP_DATE: --/--/--; CHK_APP_DATE: --/--/--; Date: *******; ApprovedBy: *******; CheckedBy: None; Author: *******; CompanyName: *******; DrawnBy: Name; Engineer: *******; Organization: *******; Address1: *******; Address2: *******; Address3: *******; Address4: *******; DocumentNumber: Doc Num; Revision: *******; SheetNumber: 6; SheetTotal: 7; CurrentTime: *******; CurrentDate: *******; Time: *******; DocumentFullPathAndName: *******; DocumentName: *******; ModifiedDate: *******; ImagePath: *******; ProjectName: *******; Application_BuildNumber: *******
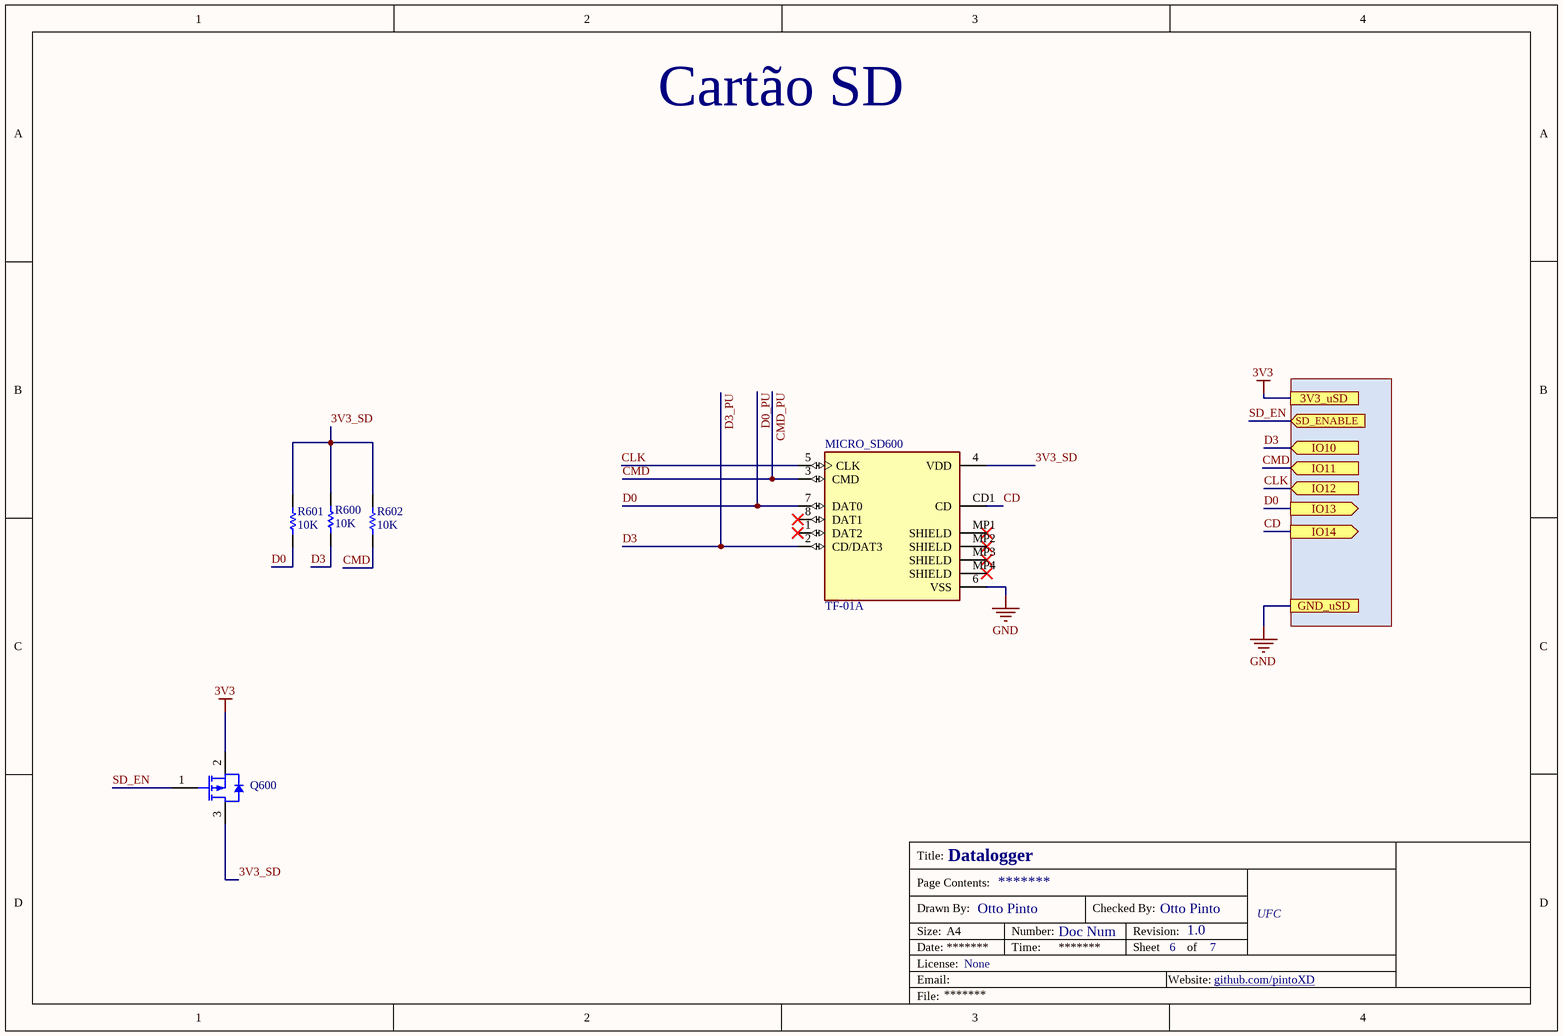
[diagram p5: MicroSD.SchDoc]

### Parts
MICRO_SD600  TF-01A  [TF-01A]
Q600  IC MOSFET P_CHANNEL 20V 6A  [SOT-23]  (value not drawn)
R600  10K  [CR2012-0805]
R601  10K  [CR2012-0805]
R602  10K  [CR2012-0805]

### Ports
3V3_uSD, GND_uSD, IO10 (in), IO11 (in), IO12 (in), IO13 (out), IO14 (out), SD_ENABLE (in)

### Nets
3V3: Q600.2(SOURCE) ; port 3V3_uSD
GND: MICRO_SD600.6(VSS) ; port GND_uSD
3V3_SD: MICRO_SD600.4(VDD) Q600.3(DRAIN) R600.2 R601.2 R602.2
CD: MICRO_SD600.CD1(CD) ; port IO14
CLK: MICRO_SD600.5(CLK) ; port IO12
CMD: MICRO_SD600.3(CMD) R602.1 ; port IO11  [also labelled CMD_PU]
D0: MICRO_SD600.7(DAT0) R601.1 ; port IO13  [also labelled D0_PU]
D3: MICRO_SD600.2(CD/DAT3) R600.1 ; port IO10  [also labelled D3_PU]
SD_EN: Q600.1(GATE) ; port SD_ENABLE

Not connected (* = marked no-connect by the designer): MICRO_SD600 1(DAT2)* 8(DAT1)* MP1(SHIELD)* MP2(SHIELD)* MP3(SHIELD)* MP4(SHIELD)*

### Notes on the sheet
- Title:
- Drawn By:
- Page Contents:
- Checked By:
- Size:
- Date:
- File:
- License:
- Email:
- A4
- Number:
- Time:
- Revision:
- Sheet
- Website:
- of

### Library data of the parts
MICRO_SD600 = CMP-030-000000-2: Standard Card Edge Connectors; MF: HRO Electronics Co., Ltd.; Component Type: Standard; Package: Package; Design Item ID: TF-01A; Availability: Not in stock; Price: None; Source: TF-01A.SchLib; MP: TF-01A; Value: *; Check_prices: https://www.snapeda.com/parts/TF-01A/HRO+Electronics+Co.%252C+Ltd./view-part/?ref=eda; SnapEDA_Link: https://www.snapeda.com/parts/TF-01A/HRO+Electronics+Co.%252C+Ltd./view-part/?ref=snap; Pin Count: 13
Q600 = IC MOSFET P_CHANNEL 20V 6A: as Q300 on sheet PowerSupply; ComponentLink1URL: https://datasheet.ciiva.com/30023/dmp31d0u-30023794.pdf?src-supplier=Avnet; ComponentLink1Description: https://datasheet.ciiva.com/30023/dmp31d0u-30023794.pdf?src-supplier=Avnet; Supplier 1: Avnet; RoHS: No; Category: MOSFETs; Stock 1: 12000; Pricing 1: 3000=0,10175, 6000=0,09625, 12000=0,09075, 18000=0,08525, 24000=0,07975, 30000=0,07425, 300000=0,06875 (USD); Supplier 2: LCSC; Supplier Part Number 1: SSM3J358R,LF; Supplier Part Number 2: C148356
R600-R602 = CMP-018-000030-1: as R201 on sheet Controller; ComponentLink6URL: https://datasheet.ciiva.com/16725/70260748-16725031.pdf?src-supplier=Allied+Electronics; Package / Case: 0805 (2012 Metric); Supplier Device Package: 0805; Resistance (Ohms): 10k; ComponentLink14Description: https://datasheet.ciiva.com/24440/eng-ds-1773270-l-24440188.pdf?src-supplier=Onlinecomponents.com; Operating Temperature: -55°C ~ 155°C; ComponentLink15Description: https://datasheet.ciiva.com/7731/eng-ds-1773270-l-7731311.pdf?src-supplier=Element14; ComponentLink7Description: https://datasheet.ciiva.com/46372/1678782-46372714.pdf?src-supplier=Element14; ComponentLink13Description: https://datasheet.ciiva.com/16723/70063741-16723029.pdf?src-supplier=Allied+Electronics; Contact Plating: Tin; Part Status: Active; ComponentLink11Description: https://datasheet.ciiva.com/30140/aoa0000ce2-30140236.pdf?src-supplier=Onlinecomponents.com; ComponentLink6Description: https://datasheet.ciiva.com/16725/70260748-16725031.pdf?src-supplier=Allied+Electronics; Lead Free: Lead Free; ComponentLink14URL: https://datasheet.ciiva.com/24440/eng-ds-1773270-l-24440188.pdf?src-supplier=Onlinecomponents.com; Design Item ID: RES 10K OHM 1% 1/8W 0805 SMD; ComponentLink7URL: https://datasheet.ciiva.com/46372/1678782-46372714.pdf?src-supplier=Element14; ComponentLink3Description: https://datasheet.ciiva.com/16514/aoa0000ce2-16514021.pdf?src-supplier=Avnet+Asia; Category: Resistors; ComponentLink13URL: https://datasheet.ciiva.com/16723/70063741-16723029.pdf?src-supplier=Allied+Electronics; Case Code (Imperial): 0805; Failure Rate: -; Stock 1: 2392770; ComponentLink5URL: https://datasheet.ciiva.com/16759/70260748-16759350.pdf?src-supplier=Allied+Electronics; Features: Automotive AEC-Q200; ComponentLink12URL: https://datasheet.ciiva.com/24070/aoa0000ce2-24070702.pdf?src-supplier=Mouser; ComponentLink9URL: https://datasheet.ciiva.com/7830/426256-7830745.pdf?src-supplier=Element14; Termination: SMD/SMT; ComponentLink10Description: https://datasheet.ciiva.com/17212/aoa0000ce2-17212108.pdf?src-supplier=Avnet+Europe; Length: 2mm; ComponentLink15URL: https://datasheet.ciiva.com/7731/eng-ds-1773270-l-7731311.pdf?src-supplier=Element14; ComponentLink8Description: https://datasheet.ciiva.com/46372/1678782-46372715.pdf?src-supplier=Element14; ComponentLink11URL: https://datasheet.ciiva.com/30140/aoa0000ce2-30140236.pdf?src-supplier=Onlinecomponents.com; Size / Dimension: 0.079" L x 0.049" W (2.00mm x 1.25mm); ComponentLink9Description: https://datasheet.ciiva.com/7830/426256-7830745.pdf?src-supplier=Element14; REACH SVHC: No SVHC; Source: mits.SchLib; Military Standard: Not; ComponentLink5Description: https://datasheet.ciiva.com/16759/70260748-16759350.pdf?src-supplier=Allied+Electronics; ComponentLink1Description: https://industrial.panasonic.com/cdbs/www-data/pdf/RDA0000/AOA0000C283.pdf; ComponentLink16URL: https://datasheet.ciiva.com/14181/jcrn73-data-e-14181423.pdf?src-supplier=Distrelec; Stock 2: 1650; Working Voltage: 150V; ComponentLink8URL: https://datasheet.ciiva.com/46372/1678782-46372715.pdf?src-supplier=Element14; ComponentLink10URL: https://datasheet.ciiva.com/17212/aoa0000ce2-17212108.pdf?src-supplier=Avnet+Europe; Number of Pins: 2; Height: 0.6mm; ComponentLink4Description: https://datasheet.ciiva.com/27055/1988971-27055733.pdf?src-supplier=Jameco; ComponentLink4URL: https://datasheet.ciiva.com/27055/1988971-27055733.pdf?src-supplier=Jameco; Pricing 2: 1=1,68000, 10=1,48900, 100=1,13720, 1000=0,73645 (USD); Radiation Hardening: No; ComponentLink16Description: https://datasheet.ciiva.com/14181/jcrn73-data-e-14181423.pdf?src-supplier=Distrelec; Pricing 1: 1=0.1, 10=0.036, 25=0.0264, 50=0.02, 100=0.0148, 250=0.01124, 500=0.009, 1000=0.00663 (USD); ELV: Compliant; Width: 0.049inch; RoHS: RoHS Compliant; Number of Terminations: 2; ComponentLink2Description: https://datasheet.ciiva.com/11808/0900766b80f80784-11808080.pdf?src-supplier=RSComponents; Power Rating: 125mW; ComponentLink1URL: https://industrial.panasonic.com/cdbs/www-data/pdf/RDA0000/AOA0000C283.pdf; Mount: Surface Mount; Depth: 1.25mm; Case Code (Metric): 2012; ComponentLink12Description: https://datasheet.ciiva.com/24070/aoa0000ce2-24070702.pdf?src-supplier=Mouser; ComponentLink3URL: https://datasheet.ciiva.com/16514/aoa0000ce2-16514021.pdf?src-supplier=Avnet+Asia; ComponentLink2URL: https://datasheet.ciiva.com/11808/0900766b80f80784-11808080.pdf?src-supplier=RSComponents; Height - Seated (Max): 0.028" (0.70mm); Case/Package: 0805; Max Operating Temperature: 155°C; Packaging: Cut Tape (CT); Package Quantity: 5000; Voltage Rating: 150V; Min Operating Temperature: -55°C; Composition: Thick Film